# EAGLE schematic ToF_Circuit (EAGLE 9.7.0)
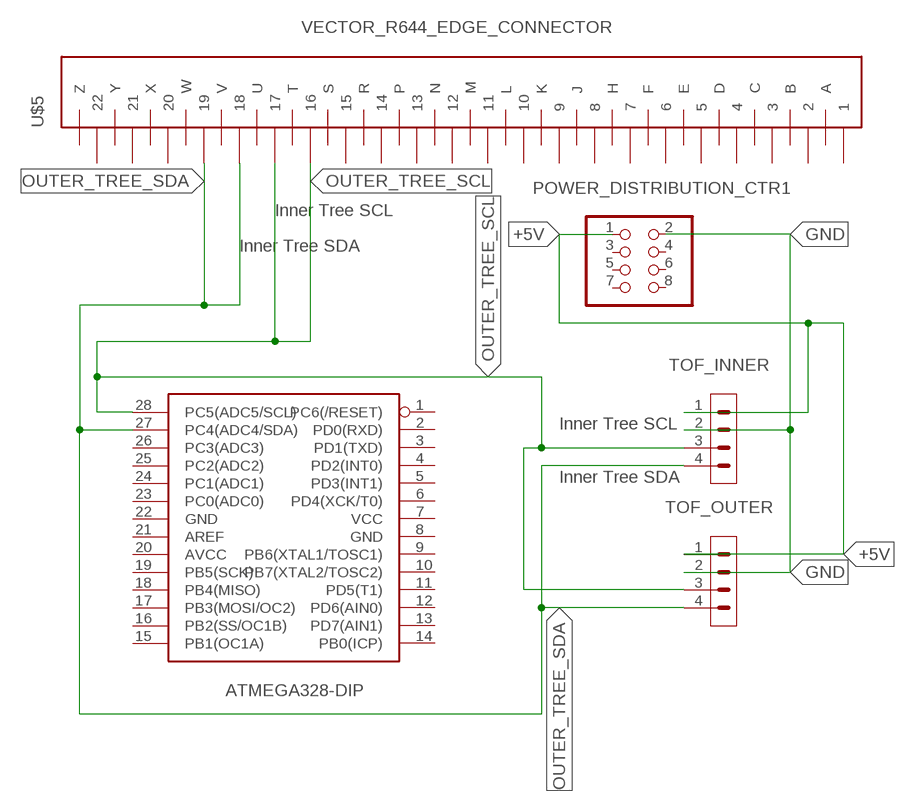
[diagram p0: schematic, sheet 1]

## Parts
POWER_DISTRIBUTION_CTR1  PINHD-2X4  [2X04]
TOF_INNER  PINHD-1X4  [1X04]
TOF_OUTER  PINHD-1X4  [1X04]
U$5  VECTOR_R644_EDGE_CONNECTOR  [VECTOR44]
U$10  ATMEGA328-DIP  [DIP28]

## Nets
+5V: POWER_DISTRIBUTION_CTR1.1 TOF_INNER.1 TOF_OUTER.1
GND: POWER_DISTRIBUTION_CTR1.2 TOF_INNER.2 TOF_OUTER.2
OUTER_TREE_SCL: TOF_INNER.3 TOF_OUTER.3 U$5.P$16 U$5.P$17 U$10.28(PC5(ADC5/SCL))
OUTER_TREE_SDA: TOF_INNER.4 TOF_OUTER.4 U$5.P$18 U$5.P$19 U$10.27(PC4(ADC4/SDA))
Unconnected: POWER_DISTRIBUTION_CTR1.3 POWER_DISTRIBUTION_CTR1.4 POWER_DISTRIBUTION_CTR1.5 POWER_DISTRIBUTION_CTR1.6 POWER_DISTRIBUTION_CTR1.7 POWER_DISTRIBUTION_CTR1.8 U$5.P$1 U$5.P$2 U$5.P$3 U$5.P$4 U$5.P$5 U$5.P$6 U$5.P$7 U$5.P$8 U$5.P$9 U$5.P$10 U$5.P$11 U$5.P$12 U$5.P$13 U$5.P$14 U$5.P$15 U$5.P$20 U$5.P$21 U$5.P$22 U$5.P$A(A) U$5.P$B(B) U$5.P$C(C) U$5.P$D(D) U$5.P$E(E) U$5.P$F(F) U$5.P$H(H) U$5.P$J(J) U$5.P$K(K) U$5.P$L(L) U$5.P$M(M) U$5.P$N(N) U$5.P$P(P) U$5.P$R(R) U$5.P$S(S) U$5.P$T(T) U$5.P$U(U) U$5.P$V(V) U$5.P$W(W) U$5.P$X(X) U$5.P$Y(Y) U$5.P$Z(Z) U$10.1(PC6(/RESET)) U$10.2(PD0(RXD)) U$10.3(PD1(TXD)) U$10.4(PD2(INT0)) U$10.5(PD3(INT1)) U$10.6(PD4(XCK/T0)) U$10.7(VCC) U$10.8(GND) U$10.9(PB6(XTAL1/TOSC1)) U$10.10(PB7(XTAL2/TOSC2)) U$10.11(PD5(T1)) U$10.12(PD6(AIN0)) U$10.13(PD7(AIN1)) U$10.14(PB0(ICP)) U$10.15(PB1(OC1A)) U$10.16(PB2(SS/OC1B)) U$10.17(PB3(MOSI/OC2)) U$10.18(PB4(MISO)) U$10.19(PB5(SCK)) U$10.20(AVCC) U$10.21(AREF) U$10.22(GND) U$10.23(PC0(ADC0)) U$10.24(PC1(ADC1)) U$10.25(PC2(ADC2)) U$10.26(PC3(ADC3))

## Notes on the sheet
- Inner Tree SCL
- Inner Tree SDA
- Inner Tree SCL
- Inner Tree SDA

## Library data of the parts
POWER_DISTRIBUTION_CTR1 = adafruit:PINHD-2X4: PIN HEADER
TOF_INNER TOF_OUTER = Connector:PINHD-1X4: Pin Header
U$5 = JDP_created_v7:VECTOR_R644_EDGE_CONNECTOR
U$10 = JDP_created_v7:ATMEGA328-DIP